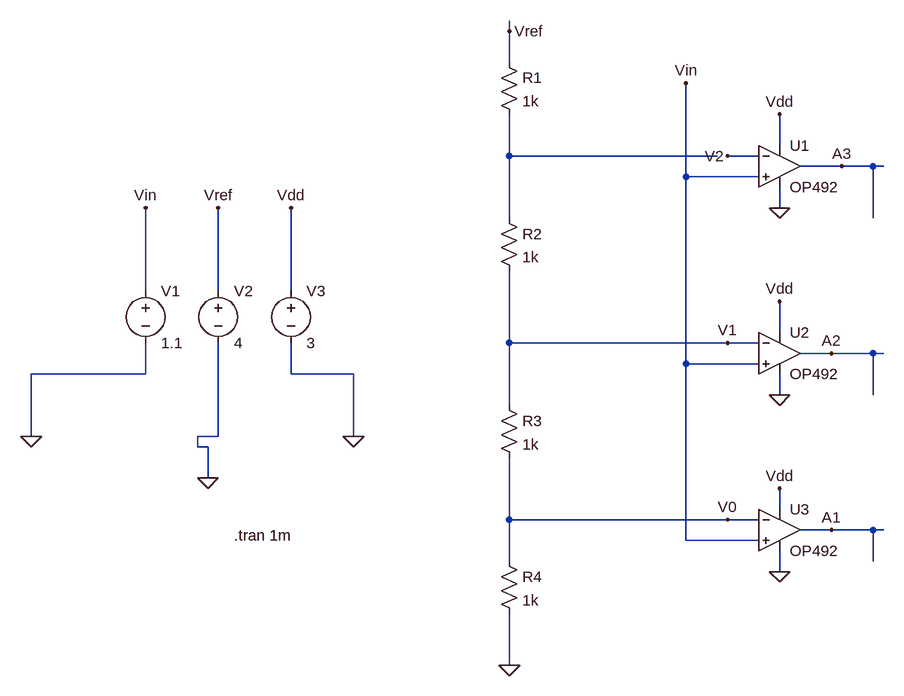
[diagram p0: schematic ahmad homework4.asc]
ahmad homework4.asc, the LTspice schematic file:
Version 4
SHEET 1 880 804
WIRE -112 -336 -112 -352
WIRE -112 -288 -112 -336
WIRE 304 -160 304 -208
WIRE -112 -144 -112 -208
WIRE 208 -144 -112 -144
WIRE 272 -144 224 -144
WIRE 400 -128 336 -128
WIRE 448 -128 400 -128
WIRE 464 -128 448 -128
WIRE 160 -112 160 -256
WIRE 272 -112 160 -112
WIRE 304 -64 304 -96
WIRE -112 -48 -112 -144
WIRE 448 -48 448 -128
WIRE -672 64 -672 -64
WIRE -560 64 -560 -64
WIRE -448 64 -448 -64
WIRE 304 128 304 80
WIRE -112 144 -112 32
WIRE 224 144 -112 144
WIRE 272 144 224 144
WIRE 384 160 336 160
WIRE 448 160 384 160
WIRE 464 160 448 160
WIRE 160 176 160 -112
WIRE 272 176 160 176
WIRE -672 192 -672 144
WIRE -672 192 -848 192
WIRE -448 192 -448 144
WIRE -352 192 -448 192
WIRE 304 224 304 192
WIRE 448 224 448 160
WIRE -112 240 -112 144
WIRE -848 288 -848 192
WIRE -560 288 -560 144
WIRE -560 288 -592 288
WIRE -352 288 -352 192
WIRE -592 304 -592 288
WIRE -576 304 -592 304
WIRE -576 352 -576 304
WIRE 304 400 304 368
WIRE -112 416 -112 320
WIRE 224 416 -112 416
WIRE 272 416 224 416
WIRE 384 432 336 432
WIRE 448 432 384 432
WIRE 464 432 448 432
WIRE 160 448 160 176
WIRE 272 448 160 448
WIRE -112 480 -112 416
WIRE 448 480 448 432
WIRE 304 496 304 464
WIRE -112 640 -112 560
FLAG -112 640 0
FLAG 304 496 0
FLAG 304 224 0
FLAG 304 -64 0
FLAG -672 -64 Vin
FLAG -560 -64 Vref
FLAG -448 -64 Vdd
FLAG -112 -336 Vref
FLAG 160 -256 Vin
FLAG 304 -208 Vdd
FLAG 304 80 Vdd
FLAG 304 368 Vdd
FLAG 224 -144 V2
FLAG 224 144 V1
FLAG 224 416 V0
FLAG 400 -128 A3
FLAG 384 160 A2
FLAG 384 432 A1
FLAG -848 288 0
FLAG -352 288 0
FLAG -576 352 0
SYMBOL voltage -672 48 R0
SYMATTR InstName V1
SYMATTR Value 1.1
SYMBOL voltage -560 48 R0
SYMATTR InstName V2
SYMATTR Value 4
SYMBOL voltage -448 48 R0
SYMATTR InstName V3
SYMATTR Value 3
SYMBOL res -128 -304 R0
SYMATTR InstName R1
SYMATTR Value 1k
SYMBOL res -128 -64 R0
SYMATTR InstName R2
SYMATTR Value 1k
SYMBOL res -128 224 R0
SYMATTR InstName R3
SYMATTR Value 1k
SYMBOL res -128 464 R0
SYMATTR InstName R4
SYMATTR Value 1k
SYMBOL OpAmps\\OP492 304 -192 R0
SYMATTR InstName U1
SYMBOL OpAmps\\OP492 304 96 R0
SYMATTR InstName U2
SYMBOL OpAmps\\OP492 304 368 R0
SYMATTR InstName U3
TEXT -536 440 Left 2 !.tran 1m

The netlist it stands for:
* ahmad homework4.asc
V1 Vin 0 1.1
V2 Vref 0 4
V3 Vdd 0 3
R1 Vref N001 1k
R2 N001 V1 1k
R3 V1 V0 1k
R4 V0 0 1k
XU1 Vin V2 Vdd 0 A3 OP492  ; pins In+ In- V+ V- OUT
XU2 Vin V1 Vdd 0 A2 OP492  ; pins In+ In- V+ V- OUT
XU3 Vin V0 Vdd 0 A1 OP492  ; pins In+ In- V+ V- OUT
.tran 1m
.backanno
.end